# EAGLE design Programmer_Card (EAGLE 6.4)
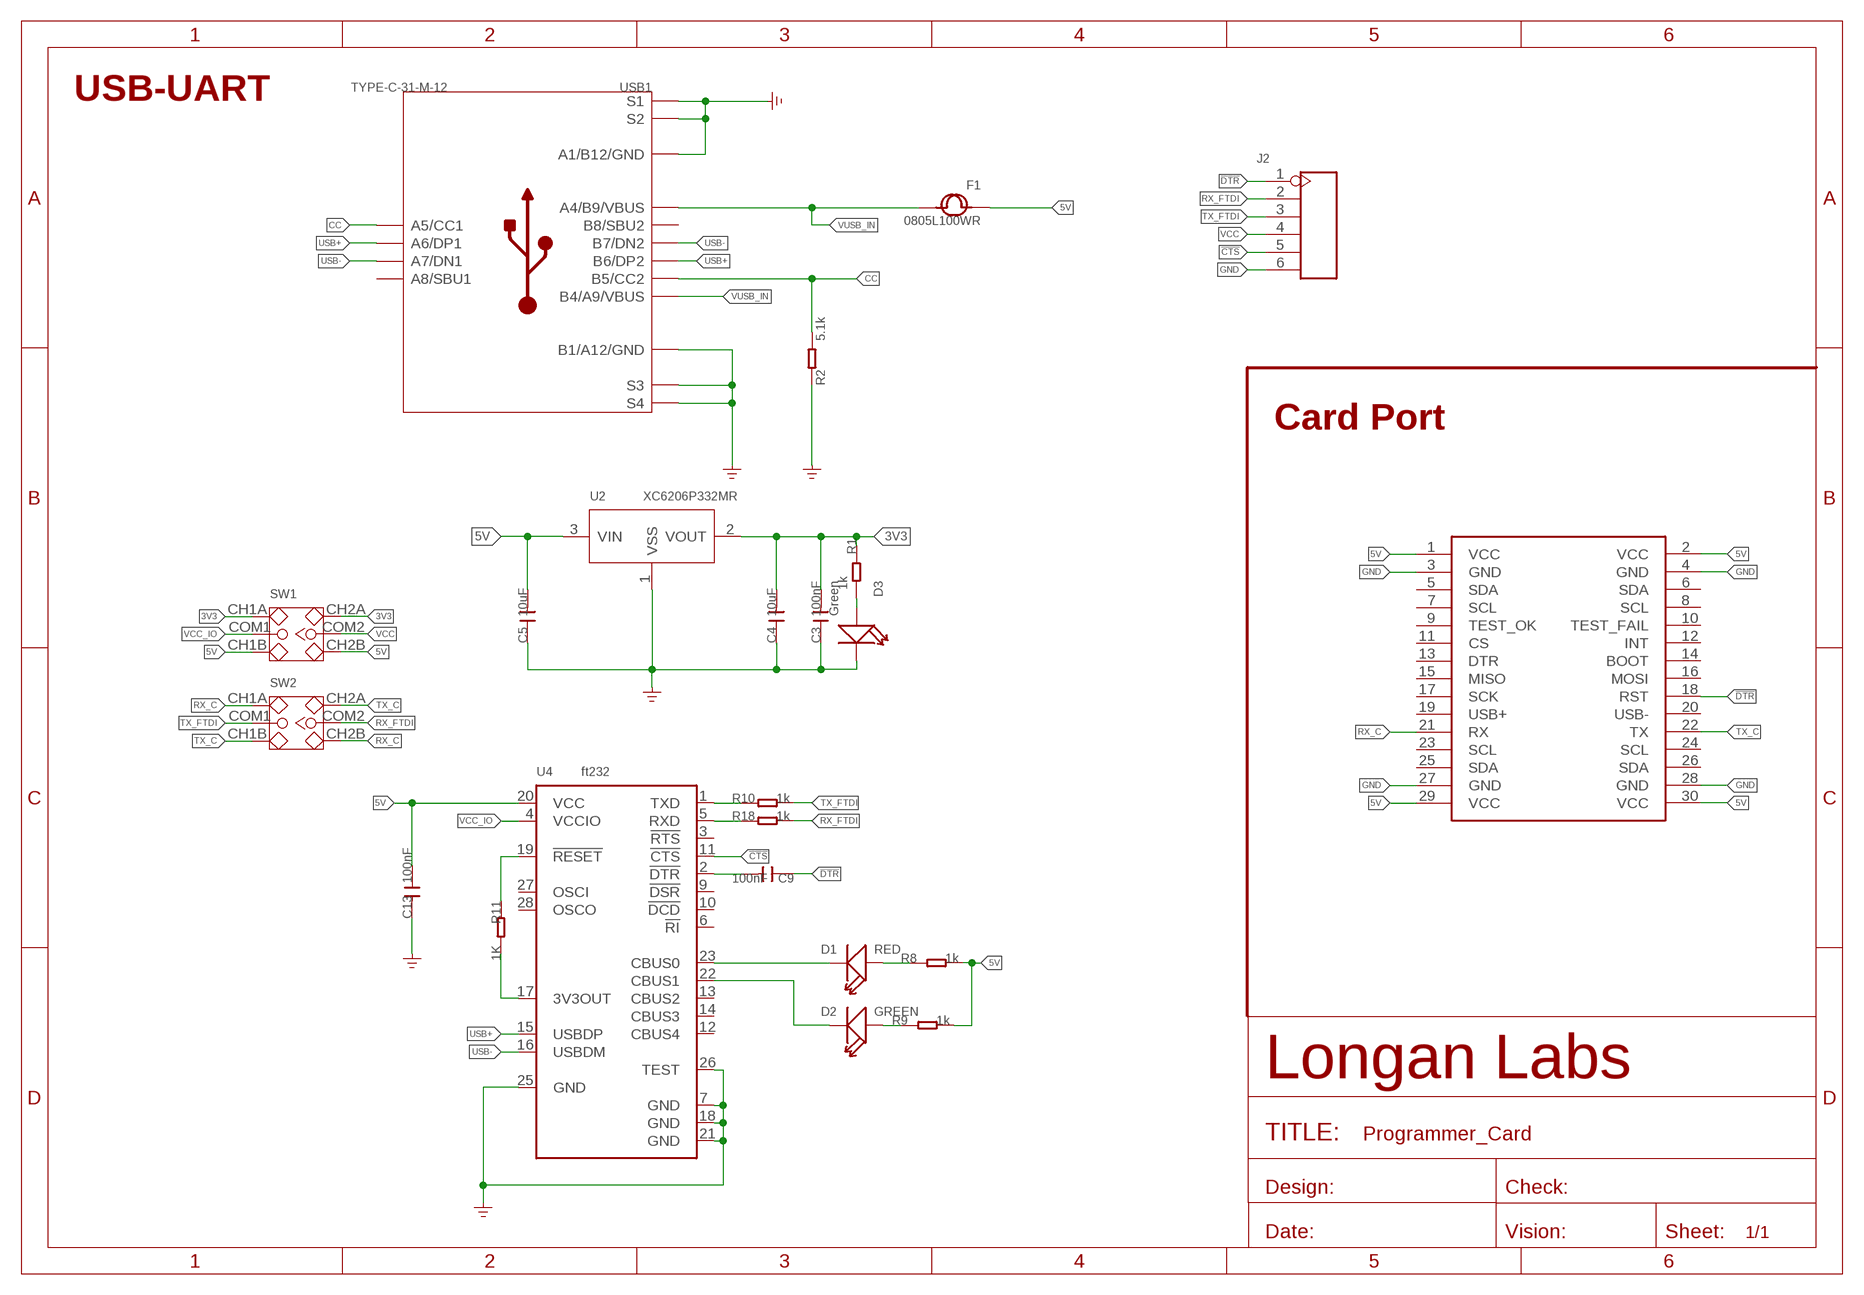
[diagram p0: schematic, sheet 1]

## Parts
C3  100nF  C-0603  [C0603]
C4  10uF  C-0603  [C0603]
C5  10uF  C-0603  [C0603]
C9  100nF  C-0603  [C0603]
C13  100nF  CAP-0603  [C0603]
D1  RED  LED'0603'  [LED-0603]
D2  GREEN  LED'0603'  [LED-0603]
D3  Green  LED'0603'  [LED-0603]
F1  0805L100WR  FUSE0805  [F0805]
J2  HEADER-6P-65/35MIL  [H6-2.54-C65D35MIL]
MOUDLE1  MOUDLE-2X15P-2.54'BOARD'  [MOUDLE-2X15P-2.54]
R1  1k  RES-0603  [R0603]
R2  5.1k  RES-0603  [R0603]
R8  1k  RES-0603  [R0603]
R9  1k  RES-0603  [R0603]
R10  1k  RES-0603  [R0603]
R11  1K  R-0603  [R0603]
R18  1k  RES-0603  [R0603]
SW1  SWITCH-2CH-6P  [SW6-2.5-SMD-9.2X3.5X3.5MM]
SW2  SWITCH-2CH-6P  [SW6-2.5-SMD-9.2X3.5X3.5MM]
U2  XC6206P332MR  PMIC-XC6206PMR  [SOT-23]
U4  ft232  INTERFACE-FT232RL-SSOP28  [SSOP28-0.65-10.2X5.2MM]
USB1  TYPE-C-31-M-12  USB2.0-TYPE-C  [USB2.0-TYPE-C]

## Nets
3V3: C3.2 C4.2 R1.1 SW1.CH1A SW1.CH2A U2.2(VOUT)
5V: C5.2 C13.1 F1.1 MOUDLE1.1(VCC) MOUDLE1.2(VCC) MOUDLE1.29(VCC) MOUDLE1.30(VCC) R8.2 R9.2 SW1.CH1B SW1.CH2B U2.3(VIN) U4.20(VCC)
!CTS: J2.5 U4.11(!CTS)
!DTR: C9.1 J2.1 MOUDLE1.18(RST)
CC: R2.2 USB1.A5(A5/CC1) USB1.B5(B5/CC2)
GND: C3.1 C4.1 C5.1 C13.2 D3.- J2.6 MOUDLE1.3(GND) MOUDLE1.4(GND) MOUDLE1.27(GND) MOUDLE1.28(GND) R2.1 U2.1(VSS) U4.7(GND) U4.18(GND) U4.21(GND) U4.25(GND) U4.26(TEST) USB1.A1_B12(A1/B12/GND) USB1.B1_A12(B1/A12/GND) USB1.S1 USB1.S2 USB1.S3 USB1.S4 USB1.S5(S1) USB1.S6(S2)
N$4: R11.2 U4.17(3V3OUT)
N$6: D3.+ R1.2
N$13: R11.1 U4.19(!RESET)
N$14: R10.1 U4.1(TXD)
N$15: D1.- U4.23(CBUS0)
N$16: D2.- U4.22(CBUS1)
N$18: D1.+ R8.1
N$19: D2.+ R9.1
N$20: R18.1 U4.5(RXD)
N$21: C9.2 U4.2(!DTR)
RX_C: MOUDLE1.21(RX) SW2.CH1A SW2.CH2B
RX_FTDI: J2.2 R18.2 SW2.COM2
TX_C: MOUDLE1.22(TX) SW2.CH1B SW2.CH2A
TX_FTDI: J2.3 R10.2 SW2.COM1
USB+: U4.15(USBDP) USB1.A6(A6/DP1) USB1.B6(B6/DP2)
USB-: U4.16(USBDM) USB1.A7(A7/DN1) USB1.B7(B7/DN2)
VCC: J2.4 SW1.COM2
VCC_IO: SW1.COM1 U4.4(VCCIO)
VUSB_IN: F1.2 USB1.A4_B9(A4/B9/VBUS) USB1.B4_A9(B4/A9/VBUS)
Unconnected: MOUDLE1.5(SDA) MOUDLE1.6(SDA) MOUDLE1.7(SCL) MOUDLE1.8(SCL) MOUDLE1.9(TEST_OK) MOUDLE1.10(TEST_FAIL) MOUDLE1.11(CS) MOUDLE1.12(INT) MOUDLE1.13(DTR) MOUDLE1.14(BOOT) MOUDLE1.15(MISO) MOUDLE1.16(MOSI) MOUDLE1.17(SCK) MOUDLE1.19(USB+) MOUDLE1.20(USB-) MOUDLE1.23(SCL) MOUDLE1.24(SCL) MOUDLE1.25(SDA) MOUDLE1.26(SDA) U4.3(!RTS) U4.6(!RI) U4.9(!DSR) U4.10(!DCD) U4.12(CBUS4) U4.13(CBUS2) U4.14(CBUS3) U4.27(OSCI) U4.28(OSCO) USB1.A8(A8/SBU1) USB1.B8(B8/SBU2)

## Notes on the sheet
- USB-UART
- Card Port

## Library data of the parts
C3-C5 C9 = Discrete:C*: Ceramic Capacitors
C13 = Discrete-new:CAP: Ceramic Capacitors
D1-D3 = Discrete-new:LED
F1 = Discrete-small:FUSE
J2 = Connector-new:HEADER-6P
MOUDLE1 = Longan-moudle:MOUDLE-2X15P-2.54
R1 R2 R8-R10 R18 = Discrete-new:RES
R11 = Discrete:R*
SW1 SW2 = LONGAN-DISCRETE:SWITCH-2CH-6P
U2 = IC-new:PMIC-XC6206P: LOW ESR Cap.Compatible Positive Voltage Regulators
U4 = IC-new:INTERFACE-FT232RL: 310070022
USB1 = Connector-new:USB2.0-TYPE-C

## Net classes
2 gnd: width 0.152 mm, drill 0.152 mm, clearance 0.152 mm
3 usbvcc: width 0.152 mm, drill 0.152 mm, clearance 0.152 mm

## Board
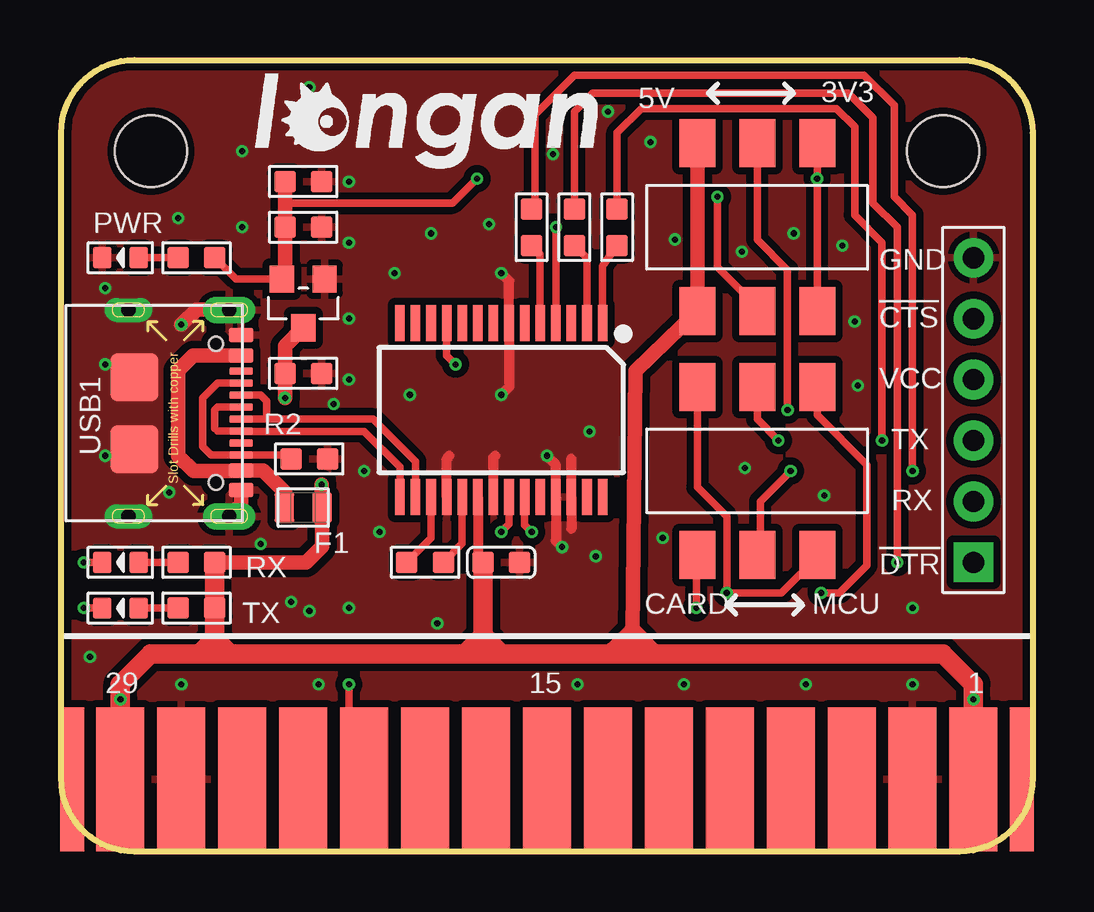
[diagram p1: board, top side]
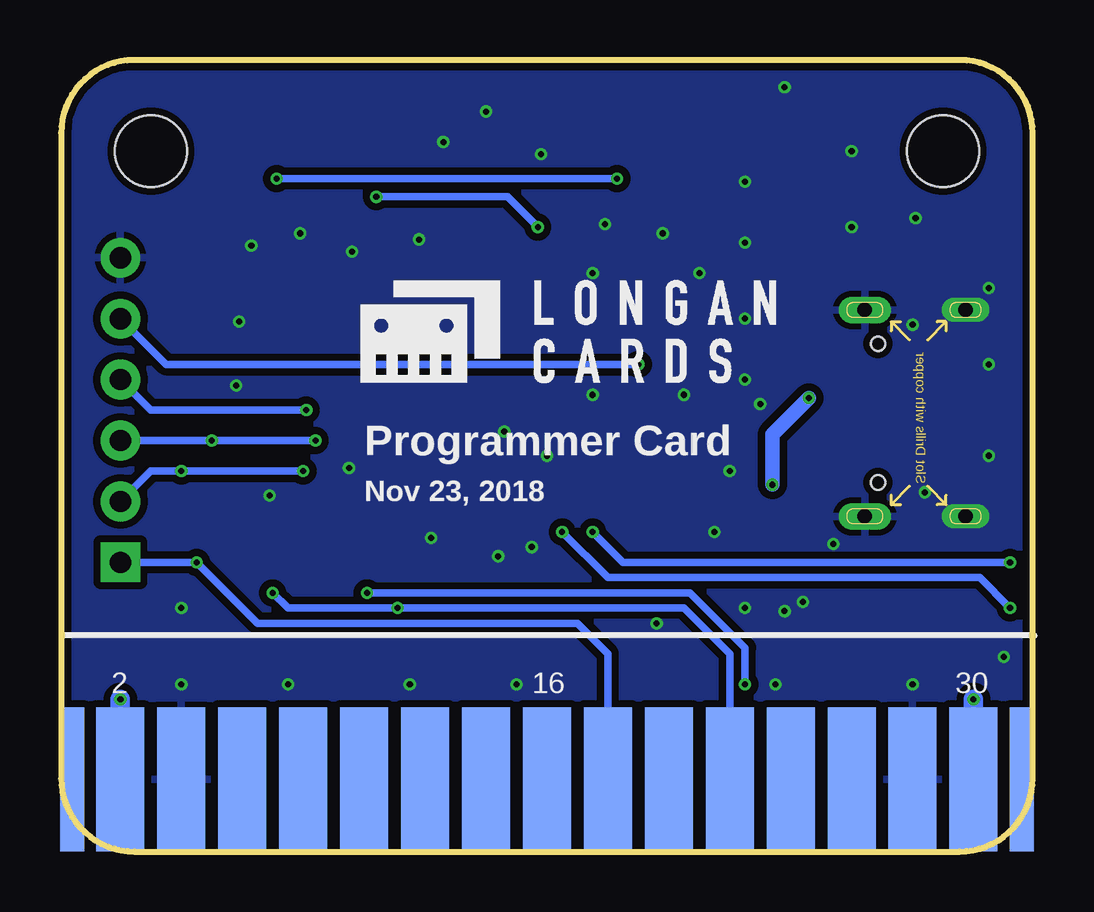
[diagram p2: board, bottom side, seen from below]

Size 40.5 x 33 mm. Coordinates in mm from the lower left corner, seen from the top.
Copper layers (1*16): Top 0.035mm / dielectric 1.5mm / Bottom 0.035mm
Design rules "SeeedStudio_2layer_DRU_no_angle_20140221": minimum track width 1mil, minimum drill 10mil, track to track 6mil, track to pad 6mil, pad to pad 6mil, via to via 6mil, smd to smd 0mil, copper to edge 10mil, drill to drill 10mil, minimum pad ring 4mil, minimum via ring 4mil, stop-mask expansion 2mil, vias tented up to drill 25mil, thermal gap 10mil

### Footprints (pad centres in the part's own frame; a part is rotated, then mirrored left to right if it is on the bottom)
C0603 = smd 0.889 x 0.889: 1 -0.762,0; 2 0.762,0
C0603' = smd 0.889 x 0.889: 1 0,0.762; 2 0,-0.762
LED-0603 = smd 0.762 x 0.889: + -0.762,0; - 0.762,0
F0805 = smd 0.819 x 1.27: 1 -0.79,0; 2 0.79,0
H6-2.54-C65D35MIL = drill 0.889 pad 1.651 square: 1 0,6.35 | drill 0.889 pad 1.651: 2 0,3.81; 3 0,1.27; 4 0,-1.27; 5 0,-3.81; 6 0,-6.35
MOUDLE-2X15P-2.54 = smd 2 x 6: 1 17.78,-13.492; 3 15.24,-13.492; 5 12.7,-13.492; 7 10.16,-13.492; 9 7.62,-13.492; 11 5.08,-13.492; 13 2.54,-13.492; 15 0,-13.492; 17 -2.54,-13.492; 19 -5.08,-13.492; 21 -7.62,-13.492; 23 -10.16,-13.492; 25 -12.7,-13.492; 27 -15.24,-13.492; 29 -17.78,-13.492 | smd 2 x 6 bottom: 2 17.78,-13.492; 4 15.24,-13.492; 6 12.7,-13.492; 8 10.16,-13.492; 10 7.62,-13.492; 12 5.08,-13.492; 14 2.54,-13.492; 16 0,-13.492; 18 -2.54,-13.492; 20 -5.08,-13.492; 22 -7.62,-13.492; 24 -10.16,-13.492; 26 -12.7,-13.492; 28 -15.24,-13.492; 30 -17.78,-13.492 | smd 1 x 6: P1 -19.8,-13.492; P4 19.8,-13.492 | smd 1 x 6 bottom: P2 -19.8,-13.492; P3 19.8,-13.492 | hole 3: -16.51,12.7; 16.51,12.7
R0603 = smd 0.889 x 0.889: 1 0,0.762; 2 0,-0.762
R0603' = smd 0.889 x 0.889: 1 -0.762,0; 2 0.762,0
SW6-2.5-SMD-9.2X3.5X3.5MM = smd 1.5 x 2: CH1A -2.5,3.5; CH1B 2.5,3.5; CH2A -2.5,-3.5; CH2B 2.5,-3.5; COM1 0,3.5; COM2 0,-3.5
SOT-23 = smd 1.016 x 1.143: 1 -0.889,-1.016; 2 0.889,-1.016; 3 0,1.016
SSOP28-0.65-10.2X5.2MM = smd 0.4 x 1.5: 1 -4.225,-3.625; 2 -3.575,-3.625; 3 -2.925,-3.625; 4 -2.275,-3.625; 5 -1.625,-3.625; 6 -0.975,-3.625; 7 -0.325,-3.625; 8 0.325,-3.625; 9 0.975,-3.625; 10 1.625,-3.625; 11 2.275,-3.625; 12 2.925,-3.625; 13 3.575,-3.625; 14 4.225,-3.625; 15 4.225,3.625; 16 3.575,3.625; 17 2.925,3.625; 18 2.275,3.625; 19 1.625,3.625; 20 0.975,3.625; 21 0.325,3.625; 22 -0.325,3.625; 23 -0.975,3.625; 24 -1.625,3.625; 25 -2.275,3.625; 26 -2.925,3.625; 27 -3.575,3.625; 28 -4.225,3.625
USB2.0-TYPE-C = smd 1 x 0.6: A1_B12 -0.05,3.25; A4_B9 -0.05,2.4; B1_A12 -0.05,-3.2; B4_A9 -0.05,-2.4 | smd 1 x 0.3: A5 -0.05,1.25; A6 -0.05,0.25; A7 -0.05,-0.25; A8 -0.05,-1.25; B5 -0.05,-1.75; B6 -0.05,-0.75; B7 -0.05,0.75; B8 -0.05,1.75 | drill 0.6 pad 1 long: S1 -4.75,4.3; S2 -4.75,-4.3 | drill 0.6 pad 1.1 long: S3 -0.55,4.3; S4 -0.55,-4.3 | smd 2 x 2: S5 -4.5,1.5; S6 -4.5,-1.5 | hole 0.6: -1.1,-2.89; -1.1,2.89

### Placement (x,y rotation side)
C3  10.09,26.02 180 top
C4  10.09,27.93 180 top
C5  10.09,19.93 180 top
C9  21.39,26.02 270 top
C13  100nF  [C0603']  18.34,12.05 90 top
D1  2.47,10.15 180 top
D2  2.47,12.05 180 top
D3  2.47,24.76 180 top
F1  10.09,14.34 180 top
J2  38.03,18.41 180 top
MOUDLE1  20.25,16.5 0 top
R1  5.64,24.76 270 top
R2  10.34,16.37 270 top
R8  5.64,10.15 90 top
R9  5.64,12.05 90 top
R10  23.17,26.02 180 top
R11  1K  [R0603']  15.17,12.05 180 top
R18  19.61,26.02 180 top
SW1  29.01,26.02 180 top
SW2  29.01,15.87 0 top
U2  10.09,22.85 180 top
U4  18.34,18.41 180 top
U$1  [LONGAN-SILK-SMALLER]  6.79,27.3 0 top
U$6  [LONGAN-CARDS-MIDDLE]  28.76,19.04 0 bottom
USB1  7.55,18.28 0 top

### Tracks (layer width: path | path; a pad name or v marks a point on that pad's centre or on a via)
3V3  (via drill 0.25 pad 0.51)
  Top 0.305: U2.2 7.3,23.87 R1.1 | C4.2 9.33,27.17 9.46,27.04 16.31,27.04 v17.33,28.06 | SW1.CH2A v31.51,28.06 SW1.CH1A
  Top 0.61: C4.2 C3.2 9.33,23.99 U2.2
  Bottom 0.305: v17.33,28.06 v31.51,28.06
5V  (via drill 0.25 pad 0.51)
  Top 0.406: 9.3,19.7 C5.2 9.46,19.93 | U4.20 17.37,12.27 C13.1 | 9.2,20.18 9.33,20.06 | 9.36,19.7 9.46,19.8
  Top 0.61: R9.2 10.22,12.05 10.88,12.72 F1.1 10.85,14.37 v10.85,15.29 | U2.3 9.33,21.07 9.33,20.06 C5.2 | v9.33,18.91 C5.2 | 9.36,19.7 9.36,19.9 C5.2 | 23.81,9.13 23.93,20.02 SW1.CH1B SW1.CH2B
  Top 0.813: 9.3,19.96 C5.2 | R9.2 R8.2 6.41,8.88 | MOUDLE1.30 v2.47,6.34 2.47,6.97 3.74,8.24 5.77,8.24 | 5.77,8.24 6.28,8.24 | 6.28,8.24 7.04,8.24 | 7.04,8.24 16.82,8.24 | 16.82,8.24 17.46,8.24 | 17.46,8.24 18.34,8.24 | 18.34,8.24 23.81,8.24 | 23.81,8.24 24.7,8.24 | 24.7,8.24 36.76,8.24 38.03,6.97 v38.03,6.34 MOUDLE1.2 | C13.1 17.58,9.01 | 17.58,9.01 17.58,8.37 17.46,8.24 | 6.41,8.88 6.41,8.37 6.28,8.24 | 17.58,9.01 18.34,8.24 | 17.58,9.01 16.82,8.24 | 23.81,9.13 23.81,8.24 | 24.7,8.24 23.81,9.13 | 23.81,9.13 23.04,8.37 | 7.04,8.24 6.41,8.88 | 6.41,8.88 5.77,8.24
  Bottom 0.61: v10.85,15.29 10.85,17.39 v9.33,18.91
  Bottom 0.813: v2.47,6.34 MOUDLE1.30 | v38.03,6.34 MOUDLE1.2
!CTS  (via drill 0.25 pad 0.51)
  Top 0.305: U4.11 16.07,20.68 v16.44,20.31
  Bottom 0.305: J2.5 36.12,20.31 v16.44,20.31
!DTR  (via drill 0.25 pad 0.51)
  Top 0.305: v34.86,12.05 34.86,26.02 33.84,27.04 33.84,30.6 32.82,31.61 22.16,31.61 21.39,30.85 C9.1
  Bottom 0.305: MOUDLE1.18 17.71,8.24 18.98,9.52 32.31,9.52 v34.86,12.05 J2.1
CC
  Top 0.305: USB1.A5 6.51,19.53 5.9,18.91 5.9,16.88 6.25,16.53 USB1.B5 9.43,16.53 R2.2
GND  (via drill 0.25 pad 0.51)
  Top 0.406: v18.34,19.04 18.67,19.37 U4.7 18.67,23.8 v18.34,24.12 | U4.21 18.02,16.43 18.09,16.5 | U4.18 16.07,16.38 16.19,16.5 | v20.25,16.5 20.62,16.13 U4.25 20.62,12.96 v20.89,12.69 | 21.27,13.45 21.27,13.46 U4.26 21.27,16.37
  Top 0.61: USB1.B1_A12 7.5,14.48 USB1.S4 | v5.01,21.96 5.64,22.6 6.98,22.6 USB1.S3
  other vias: 9.58,10.4 11.99,10.15 5.01,6.97 10.72,6.97 22.28,12.31 35.49,10.15 35.49,6.97 31.05,6.97 25.96,6.97 21.52,6.97 22.03,17.52 14.54,19.04 11.99,19.68 11.99,22.21 11.99,25.39 11.99,27.93 7.55,26.02 7.55,29.2 4.88,26.41 1.84,23.48 1.84,16.5 1.84,20.31 11.36,18.66 12.63,15.87 13.27,13.32 8.31,12.82 4.5,14.98 10.34,10.02 24.57,29.58 17.84,26.15 10.34,31.87 15.42,25.77 13.9,24.12 1.2,8.12 15.68,9.52 32.57,25.26 30.54,25.77 28.38,25.01 25.58,25.52 33.08,22.09 33.2,19.42 28.51,15.99 31.81,14.85 25.08,13.07 20.5,29.07 22.79,30.85
  pour Top (isolate 0.305): -0.83,33.64 41.2,33.64 41.2,-1.28 -0.83,-1.28
  pour Bottom (isolate 0.305): -0.83,33.64 41.2,33.64 41.2,-1.28 -0.83,-1.28
N$4
  Top 0.305: U4.17 15.42,13.07 R11.2
N$6
  Top 0.305: R1.2 D3.+
N$13
  Top 0.305: U4.19 16.72,12.84 R11.1
N$14
  Top 0.305: U4.1 22.57,24.41 R10.1
N$15  (via drill 0.25 pad 0.51)
  Top 0.305: D1.- v0.95,10.15 | U4.23 19.32,13.62 v19.61,13.32
  Bottom 0.305: v19.61,13.32 17.71,11.42 2.22,11.42 v0.95,10.15
N$16  (via drill 0.25 pad 0.51)
  Top 0.305: D2.- v0.95,12.05 | U4.22 18.67,13.65 v18.34,13.32
  Bottom 0.305: v18.34,13.32 17.07,12.05 v0.95,12.05
N$18
  Top 0.305: R8.1 D1.+
N$19
  Top 0.305: R9.1 D2.+
N$20
  Top 0.305: U4.5 19.97,24.91 R18.1
N$21
  Top 0.305: U4.2 21.92,24.74 C9.2
RX_C  (via drill 0.25 pad 0.51)
  Top 0.305: MOUDLE1.21 12.63,5.07 11.99,5.71 v11.99,6.97 | SW2.CH2B 31.68,12.68 31.68,12.44 30.03,10.79 v27.74,10.79 27.74,13.96 26.51,15.19 SW2.CH1A
  Bottom 0.305: v11.99,6.97 11.99,8.5 14.28,10.79 v27.74,10.79
RX_FTDI  (via drill 0.25 pad 0.51)
  Top 0.305: R18.2 19.74,26.79 19.74,30.72 21.39,32.38 33.46,32.38 34.73,31.11 34.73,27.3 35.49,26.53 v35.49,15.87 | SW2.COM2 29.14,12.49 29.14,14.6 v30.41,15.87
  Bottom 0.305: v30.41,15.87 v35.49,15.87 36.76,15.87 J2.2
TX_C  (via drill 0.25 pad 0.51)
  Top 0.305: 25.96,12.75 SW2.CH2A 26.47,12.32 v26.47,10.15 | v31.68,10.79 32.44,10.79 33.59,11.93 33.59,16.12 31.51,18.19 SW2.CH1B
  Bottom 0.305: MOUDLE1.22 12.63,8.24 14.54,10.15 v26.47,10.15 31.05,10.15 v31.68,10.79
TX_FTDI  (via drill 0.25 pad 0.51)
  Top 0.305: v34.22,17.14 34.22,25.39 33.08,26.53 33.08,30.22 32.31,30.98 24.19,30.98 23.17,29.96 R10.2 | SW2.COM1 29.01,18.02 v29.9,17.14
  Bottom 0.305: J2.3 v34.22,17.14 v29.9,17.14
USB+
  Top 0.305: U4.15 14.12,16.03 12.63,17.52 7.51,17.52 USB1.B6 6.52,17.53 6.41,17.64 6.41,18.41 6.53,18.53 USB1.A6
USB-
  Top 0.305: U4.16 14.77,16.27 13.01,18.02 8.57,18.02 | 8.57,18.02 USB1.A7 | USB1.B7 8.32,19.03 8.57,18.79 8.57,18.02
VCC  (via drill 0.25 pad 0.51)
  Top 0.305: v30.28,18.41 30.28,24.25 29.01,25.52 SW1.COM2
  Bottom 0.305: v30.28,18.41 36.76,18.41 J2.4
VCC_IO  (via drill 0.25 pad 0.51)
  Top 0.305: U4.4 20.62,26.01 v20.63,26.02 | v27.36,27.3 27.36,24.37 28.76,22.98 28.76,22.78 SW1.COM1
  Bottom 0.305: v27.36,27.3 21.9,27.3 v20.63,26.02
VUSB_IN
  Top 0.61: F1.2 9.33,14.37 9.33,14.98 8.43,15.88 USB1.B4_A9 7.49,15.87 5.52,15.87 4.88,16.5 4.88,20.06 5.51,20.68 USB1.A4_B9

### Text on the board
tPlace: 3V3 | 5V | PWR | GND | !CTS | VCC | TX | RX | RX | !DTR | TX | CARD | MCU
bPlace: Programmer Card | Nov 23, 2018